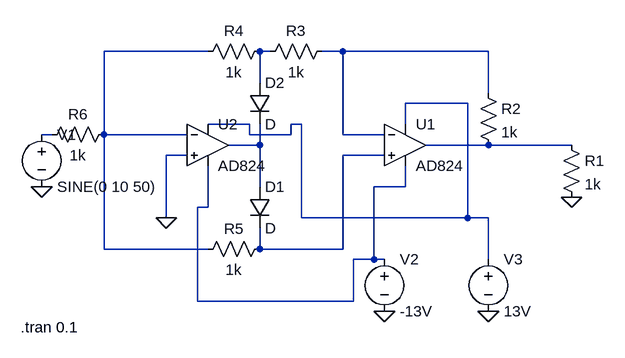
[diagram p0: schematic Draft2.asc]
Draft2.asc, the LTspice schematic file:
Version 4
SHEET 1 880 680
WIRE -96 16 -256 16
WIRE 0 16 -16 16
WIRE 112 16 80 16
WIRE 336 16 112 16
WIRE -16 64 -16 16
WIRE 336 80 336 16
WIRE 304 96 208 96
WIRE -32 128 -96 128
WIRE 48 128 32 128
WIRE 208 128 208 96
WIRE -336 144 -352 144
WIRE -256 144 -256 16
WIRE -128 144 -256 144
WIRE -32 144 -32 128
WIRE 32 144 32 128
WIRE 32 144 -32 144
WIRE 112 144 112 16
WIRE 176 144 112 144
WIRE -16 160 -16 128
WIRE -16 160 -64 160
WIRE 336 160 240 160
WIRE 464 160 336 160
WIRE -128 176 -160 176
WIRE 176 176 112 176
WIRE -16 224 -16 160
WIRE 208 224 208 192
WIRE 208 224 160 224
WIRE -96 256 -96 192
WIRE -96 256 -112 256
WIRE -160 272 -160 176
WIRE 48 272 48 128
WIRE 304 272 304 96
WIRE 304 272 48 272
WIRE 336 272 304 272
WIRE -256 320 -256 144
WIRE -96 320 -256 320
WIRE -16 320 -16 288
WIRE 112 320 112 176
WIRE 112 320 -16 320
WIRE 160 336 160 224
WIRE 160 336 128 336
WIRE 176 336 160 336
WIRE 336 336 336 272
WIRE -112 400 -112 256
WIRE 128 400 128 336
WIRE 128 400 -112 400
FLAG 464 240 0
FLAG -352 224 0
FLAG -160 272 0
FLAG 176 416 0
FLAG 336 416 0
SYMBOL OpAmps\\AD824 208 96 R0
SYMATTR InstName U1
SYMBOL res 448 144 R0
SYMATTR InstName R1
SYMATTR Value 1k
SYMBOL res 320 64 R0
SYMATTR InstName R2
SYMATTR Value 1k
SYMBOL res -16 32 R270
WINDOW 0 32 56 VTop 2
WINDOW 3 0 56 VBottom 2
SYMATTR InstName R3
SYMATTR Value 1k
SYMBOL res -112 32 R270
WINDOW 0 32 56 VTop 2
WINDOW 3 0 56 VBottom 2
SYMATTR InstName R4
SYMATTR Value 1k
SYMBOL res -112 336 R270
WINDOW 0 32 56 VTop 2
WINDOW 3 0 56 VBottom 2
SYMATTR InstName R5
SYMATTR Value 1k
SYMBOL OpAmps\\AD824 -96 96 R0
SYMATTR InstName U2
SYMBOL voltage -352 128 R0
WINDOW 123 0 0 Left 0
WINDOW 39 0 0 Left 0
SYMATTR InstName V1
SYMATTR Value SINE(0 10 50)
SYMBOL diode -32 224 R0
SYMATTR InstName D1
SYMBOL diode -32 64 R0
SYMATTR InstName D2
SYMBOL voltage 176 320 R0
WINDOW 123 0 0 Left 0
WINDOW 39 0 0 Left 0
SYMATTR InstName V2
SYMATTR Value -13V
SYMBOL voltage 336 320 R0
WINDOW 123 0 0 Left 0
WINDOW 39 0 0 Left 0
SYMATTR InstName V3
SYMATTR Value 13V
SYMBOL res -352 160 R270
WINDOW 0 32 56 VTop 2
WINDOW 3 0 56 VBottom 2
SYMATTR InstName R6
SYMATTR Value 1k
TEXT -384 440 Left 2 !.tran 0.1

The netlist it stands for:
* Draft2.asc
XU1 N008 N003 N004 N009 N007 AD824  ; pins In+ In- V+ V- OUT
R1 N007 0 1k
R2 N003 N007 1k
R3 N002 N003 1k
R4 N001 N002 1k
R5 N001 N008 1k
XU2 0 N001 N004 N009 N006 AD824  ; pins In+ In- V+ V- OUT
V1 N005 0 SINE(0 10 50)
D1 N006 N008 D
D2 N002 N006 D
V2 N009 0 -13V
V3 N004 0 13V
R6 N005 N001 1k
.model D D
.lib standard.dio
.tran 0.1
.backanno
.end